# EAGLE design 3w-rgb-led-connector-mk-6.0 (EAGLE 6.5.0)
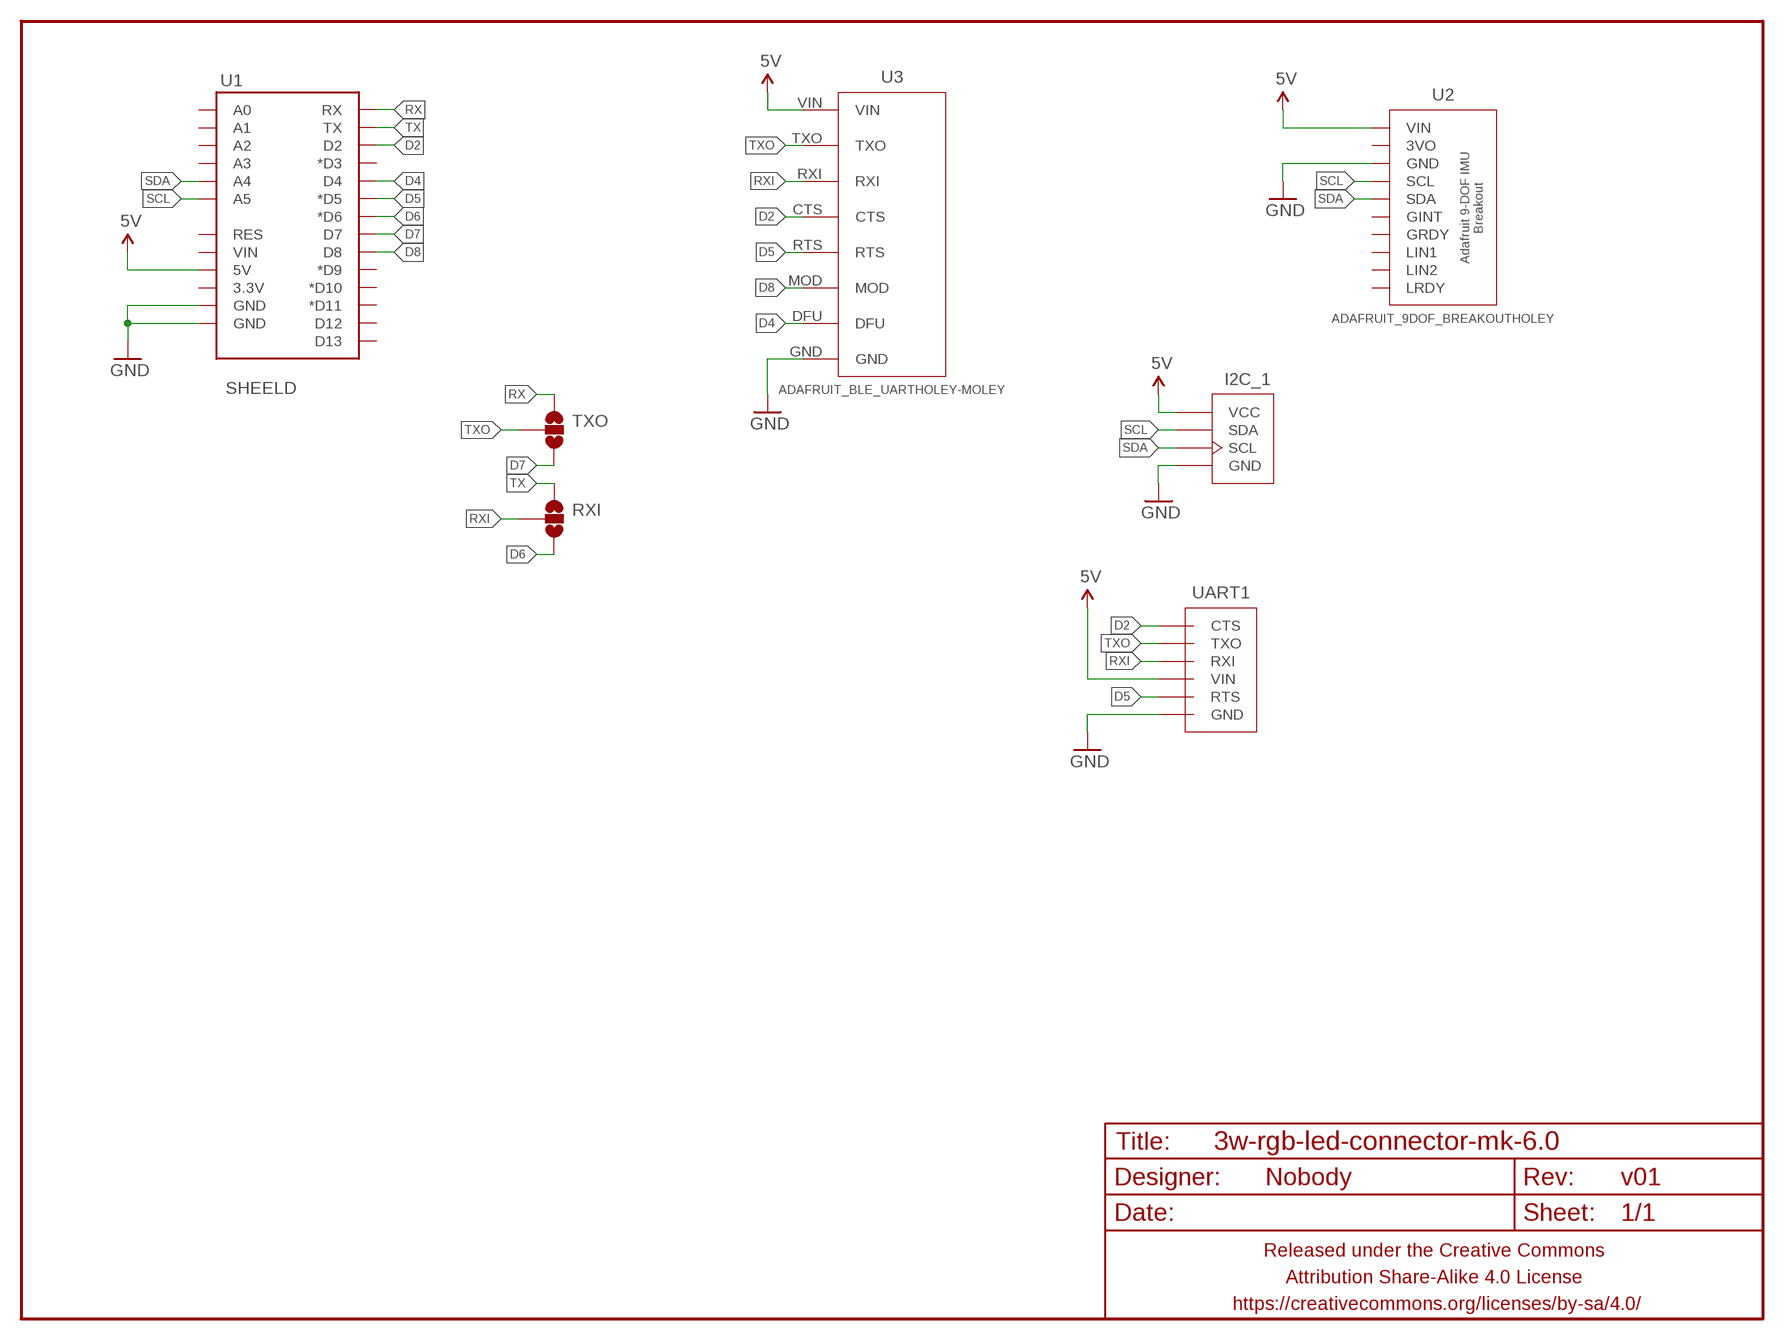
[diagram p0: schematic, sheet 1]

## Parts
FRAME1  FRAME-LETTERNO_PACKAGE  [DUMMY]
I2C_1  M04-I2CPTH-0.1IN  [1X04-PTH-VERT-I2C]
RXI  JUMPER-PAD-3-NOFULL_BOX_SILK  [PAD-JUMPER-3-NO_YES_SILK_FULL_BOX]
TXO  JUMPER-PAD-3-NOFULL_BOX_SILK  [PAD-JUMPER-3-NO_YES_SILK_FULL_BOX]
U1  SHEELD  ARDUINO_SHIELD_SMALLER  [ARDUINO_SHIELD_NOOUTLINE_INSIDE_SMALLER]
U2  ADAFRUIT_9DOF_BREAKOUTHOLEY  [ADAFRUIT_9DOF_BREAKOUT_HOLEY]
U3  ADAFRUIT_BLE_UARTHOLEY-MOLEY  [ADAFRUIT_BLE_UART_HOLEY]
UART1  M06-UARTPTH-0.1IN  [1X06_PTH_UART]

## Nets
5V: I2C_1.VCC U1.5V U2.VIN U3.VIN UART1.VCC(VIN)
D2: U1.D2 U3.CTS UART1.CTS
D4: U1.D4 U3.DFU
D5: U1.D5(*D5) U3.RTS UART1.RTS
D6: RXI.3 U1.D6(*D6)
D7: TXO.3 U1.D7
D8: U1.D8 U3.MOD
GND: I2C_1.GND U1.GND@0(GND) U1.GND@1(GND) U2.GND U3.GND UART1.GND
RX: TXO.1 U1.RX
RXI: RXI.2 U3.RXI UART1.RXI
SCL: I2C_1.SDA U1.A5 U2.SCL
SDA: I2C_1.SCL U1.A4 U2.SDA
TX: RXI.1 U1.TX
TXO: TXO.2 U3.TXO UART1.TXO
Unconnected: U1.3.3V U1.A0 U1.A1 U1.A2 U1.A3 U1.D3(*D3) U1.D9(*D9) U1.D10(*D10) U1.D11(*D11) U1.D12 U1.D13 U1.RES U1.VIN U2.3VO U2.GINT U2.GRDY U2.LIN1 U2.LIN2 U2.LRDY

## Library data of the parts
FRAME1 = A_butts:FRAME-LETTER: Schematic Frame Standard 8.5x11 US Letter frame; DESIGNER: Nobody; VERSION: v01
I2C_1 = A_butts:M04-I2C
RXI TXO = A_butts:JUMPER-PAD-3-NO
U1 = A_butts:ARDUINO_SHIELD_SMALLER
U2 = A_butts:ADAFRUIT_9DOF_BREAKOUT
U3 = A_butts:ADAFRUIT_BLE_UART
UART1 = A_butts:M06-UART

## Board
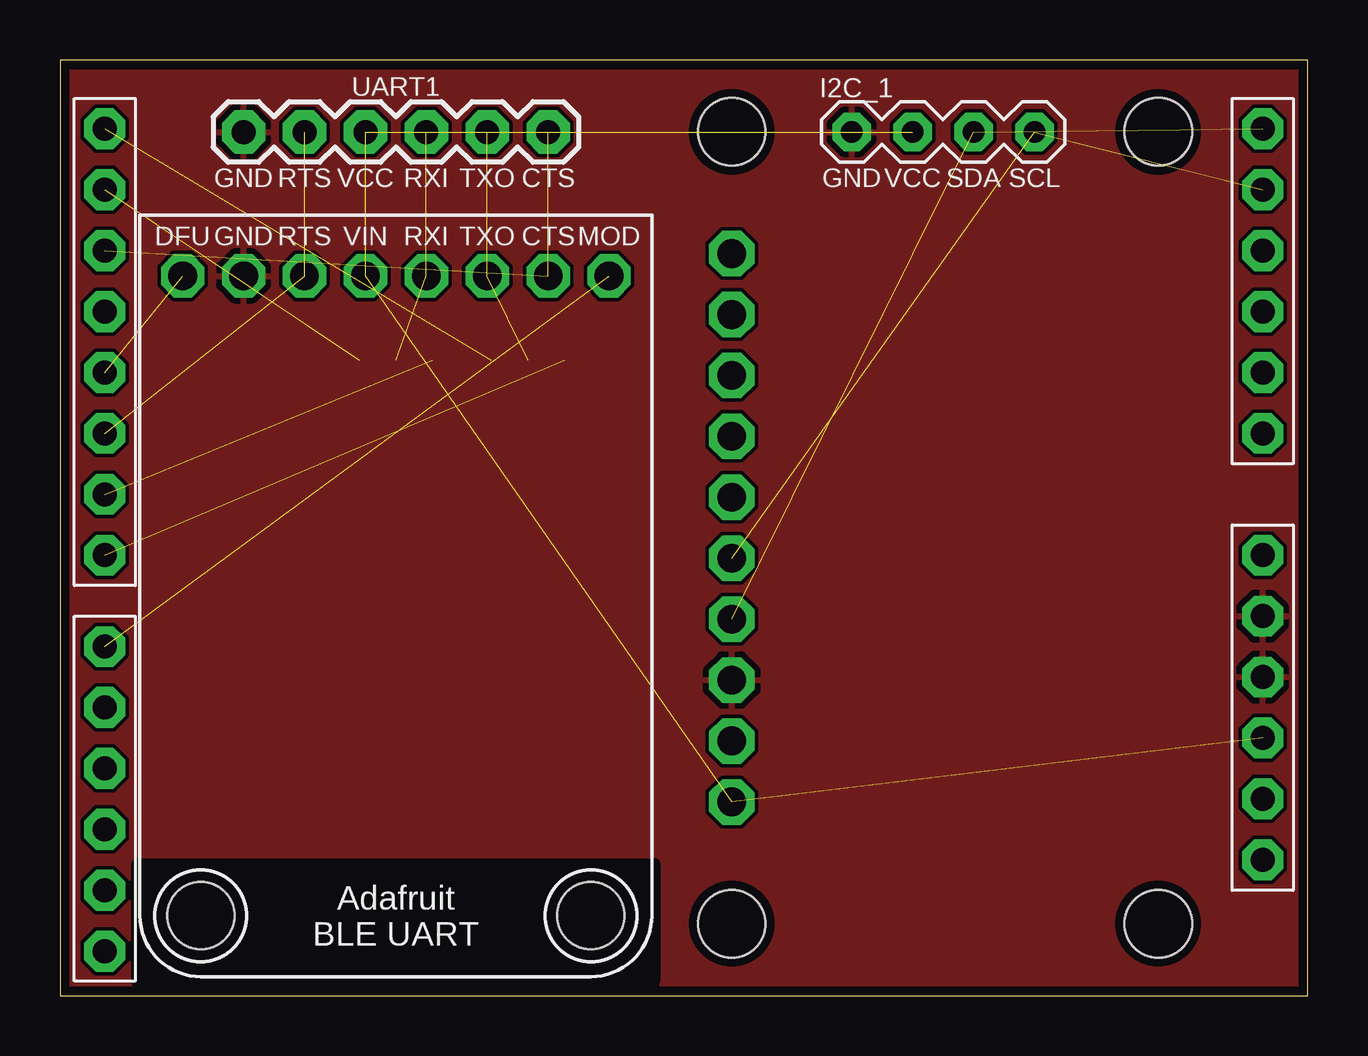
[diagram p1: board, top side]
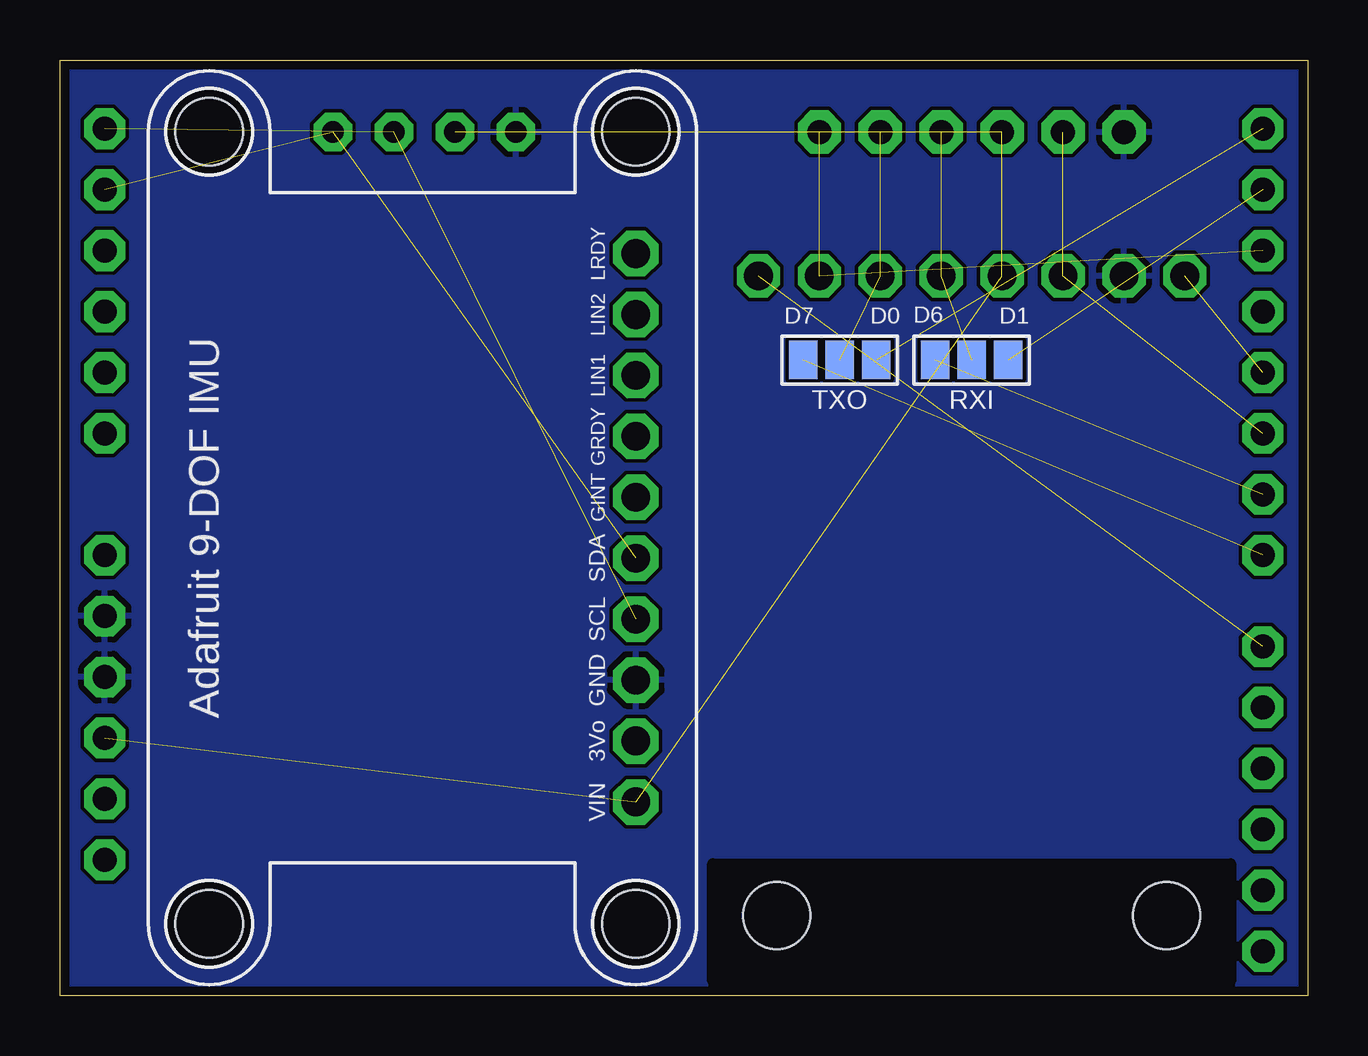
[diagram p2: board, bottom side, seen from below]

Size 52 x 39 mm. Coordinates in mm from the lower left corner, seen from the top.
Outline: 0,0 52,0 52,39 0,39 0,0
Copper layers (1*16): Top 0.0356mm / dielectric 1.5011mm / Bottom 0.0356mm
Design rules "LaenPCBOrder_2": minimum track width 6mil, minimum drill 13mil, track to track 6mil, track to pad 6mil, pad to pad 6mil, via to via 6mil, smd to smd 6mil, copper to edge 15mil, drill to drill 6mil, minimum pad ring 7mil, minimum via ring 7mil, stop-mask expansion 3mil, vias tented up to drill 20mil, thermal gap 10mil

### Footprints (pad centres in the part's own frame; a part is rotated, then mirrored left to right if it is on the bottom)
1X04-PTH-VERT-I2C = drill 0.9 pad 1.6 octagon: GND 0,0; SCL 7.62,0; SDA 5.08,0; VCC 2.54,0
PAD-JUMPER-3-NO_YES_SILK_FULL_BOX = smd 1.2 x 1.6: 1 -1.524,0; 2 0,0; 3 1.524,0
ARDUINO_SHIELD_NOOUTLINE_INSIDE_SMALLER = drill 1 pad 1.7 octagon: 3.3V 48.26,-27.94; 5V 48.26,-25.4; A0 48.26,-12.7; A1 48.26,-10.16; A2 48.26,-7.62; A3 48.26,-5.08; A4 48.26,-2.54; A5 48.26,0; D2 0,-5.08; D3 0,-7.62; D4 0,-10.16; D5 0,-12.7; D6 0,-15.24; D7 0,-17.78; D8 0,-21.59; D9 0,-24.13; D10 0,-26.67; D11 0,-29.21; D12 0,-31.75; D13 0,-34.29; GND@0 48.26,-22.86; GND@1 48.26,-20.32; RES 48.26,-30.48; RX 0,0; TX 0,-2.54; VIN 48.26,-17.78
ADAFRUIT_9DOF_BREAKOUT_HOLEY = drill 1.2 pad 1.9 octagon: 3VO -8.89,0; GINT 1.27,0; GND -6.35,0; GRDY 3.81,0; LIN1 6.35,0; LIN2 8.89,0; LRDY 11.43,0; SCL -3.81,0; SDA -1.27,0; VIN -11.43,0 | hole 2.8: -16.51,17.78; 16.51,17.78; 16.51,0; -16.51,0
ADAFRUIT_BLE_UART_HOLEY = drill 1.2 pad 1.8 octagon: CTS -6.35,0; DFU 8.89,0; GND 6.35,0; MOD -8.89,0; RTS 3.81,0; RXI -1.27,0; TXO -3.81,0; VIN 1.27,0 | hole 2.8: -8.128,26.67; 8.128,26.67
1X06_PTH_UART = drill 1 pad 1.8 octagon: CTS 12.7,0; GND 0,0; RTS 2.54,0; RXI 7.62,0; TXO 10.16,0; VCC 5.08,0

### Placement (x,y rotation side)
FRAME1  0,0 0 top
I2C_1  33,36 0 top
RXI  14,26.5 180 bottom
TXO  19.5,26.5 180 bottom
U1  1.87,36.13 0 top
U2  28,19.5 90 bottom
U3  14,30 180 top
UART1  7.65,36 0 top

### Tracks (layer width: path | path; a pad name or v marks a point on that pad's centre or on a via)
5V  (4 unrouted)
D2  (2 unrouted)
D4  (1 unrouted)
D5  (2 unrouted)
D6  (1 unrouted)
D7  (1 unrouted)
D8  (1 unrouted)
GND
  pour Top (isolate 0.152): -0.1,39.1 52.1,39.1 52.1,-0.1 -0.1,-0.1
  pour Bottom (isolate 0.152): -0.1,-0.1 -0.1,39.1 52.1,39.1 52.1,-0.1
RX  (1 unrouted)
RXI  (2 unrouted)
SCL  (2 unrouted)
SDA  (2 unrouted)
TX  (1 unrouted)
TXO  (2 unrouted)

### Text on the board
tPlace: Das Blinkenskirt!
bPlace: D1 | D6 | D0 | D7